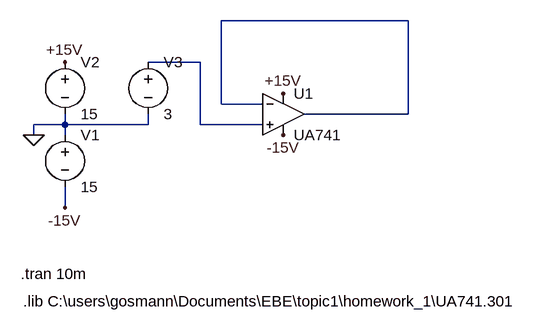
[diagram p0: schematic part2.asc]
part2.asc, the LTspice schematic file:
Version 4
SHEET 1 1120 680
WIRE 656 -192 368 -192
WIRE 336 -128 256 -128
WIRE 368 -64 368 -192
WIRE 432 -64 368 -64
WIRE 656 -48 656 -192
WIRE 656 -48 496 -48
WIRE 128 -32 128 -48
WIRE 128 -32 80 -32
WIRE 256 -32 256 -48
WIRE 256 -32 128 -32
WIRE 336 -32 336 -128
WIRE 432 -32 336 -32
WIRE 80 -16 80 -32
WIRE 128 -16 128 -32
WIRE 128 96 128 64
FLAG 80 -16 0
FLAG 128 -128 +15V
FLAG 128 96 -15V
FLAG 464 -16 -15V
FLAG 464 -80 +15V
SYMBOL OpAmps\\opamp2 464 -112 R0
SYMATTR InstName U1
SYMATTR Value UA741
SYMBOL voltage 128 -32 R0
WINDOW 123 0 0 Left 0
WINDOW 39 0 0 Left 0
SYMATTR InstName V1
SYMATTR Value 15
SYMBOL voltage 128 -144 R0
WINDOW 123 0 0 Left 0
WINDOW 39 0 0 Left 0
SYMATTR InstName V2
SYMATTR Value 15
SYMBOL voltage 256 -144 R0
WINDOW 123 0 0 Left 0
WINDOW 39 0 0 Left 0
SYMATTR InstName V3
SYMATTR Value 3
TEXT 64 240 Left 2 !.lib C:\\users\\gosmann\\Documents\\EBE\\topic1\\homework_1\\UA741.301
TEXT 60 198 Left 2 !.tran 10m

The netlist it stands for:
* part2.asc
XU1 N002 N001 +15V -15V N001 UA741  ; pins In+ In- V+ V- OUT
V1 0 -15V 15
V2 +15V 0 15
V3 N002 0 3
.lib C:\users\gosmann\Documents\EBE\topic1\homework_1\UA741.301
.tran 10m
.backanno
.end